# Altium project Room02.PrjPCB
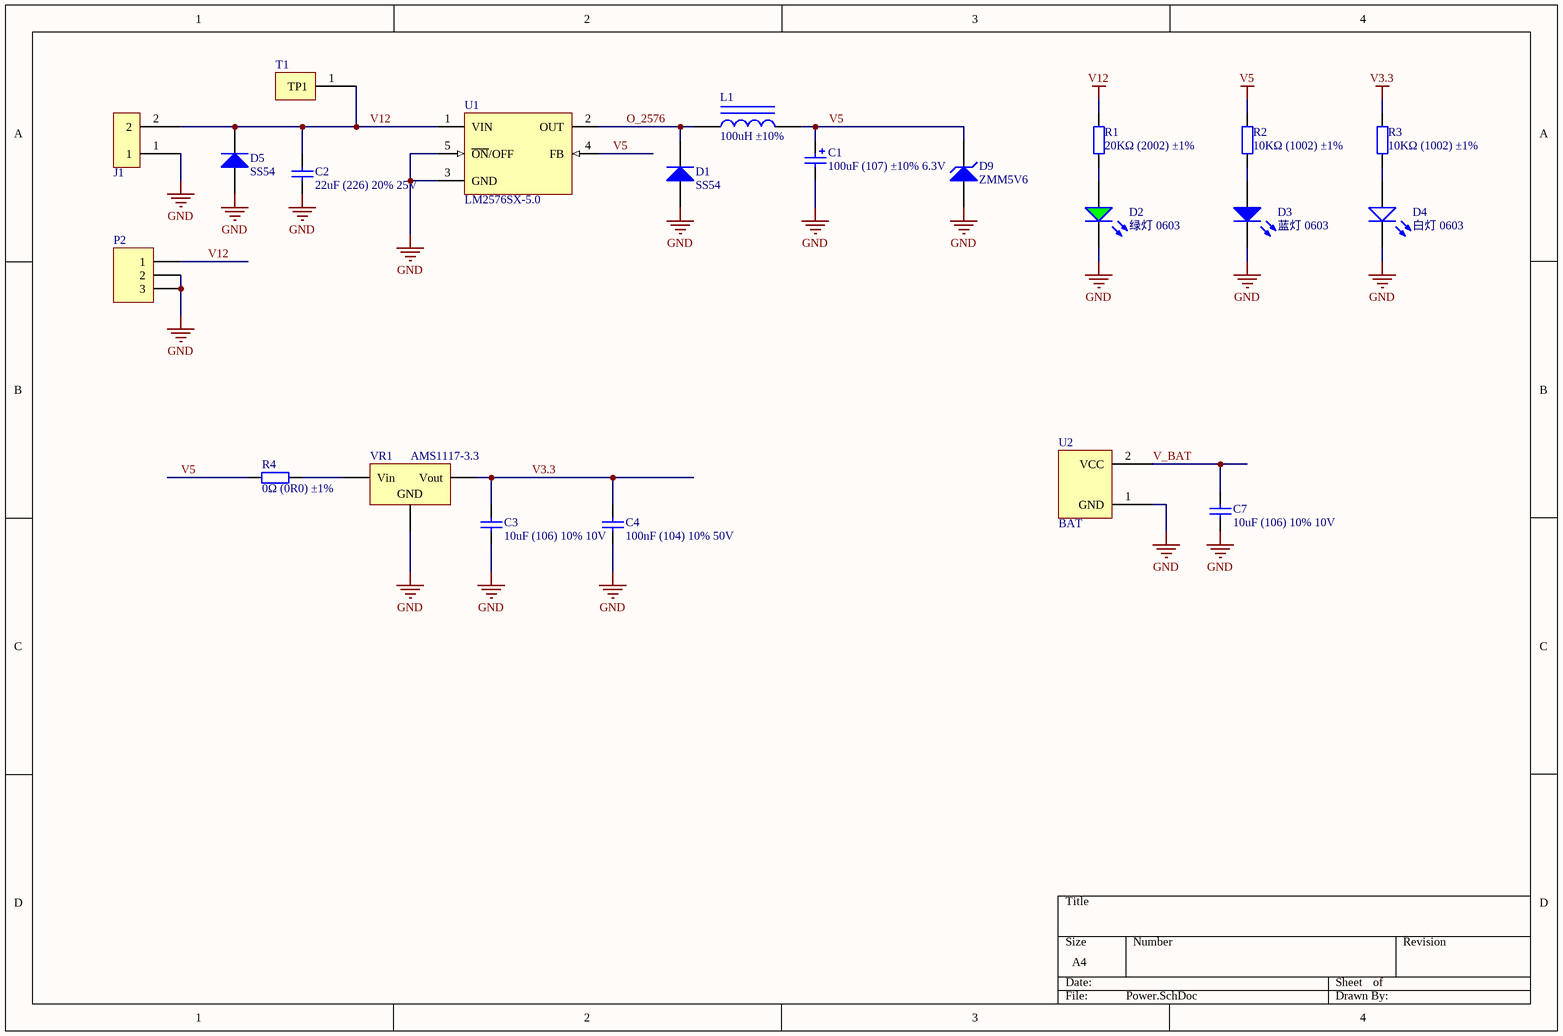
[diagram p0: Power.SchDoc]
5 sheets, 94 parts. Net scope: global (net labels, ports and power ports of the same name join across sheets).
Board file: Room02.PcbDoc
Sheets:
  Power.SchDoc
  raspi.SchDoc
  commu.SchDoc
  mcu.SchDoc
  other.SchDoc

## Sheet Power.SchDoc
size A4

### Parts
C1  100uF (107) ±10% 6.3V  [CASE-B_3528]
C2  22uF (226) 20% 25V  [0805_C]
C3  10uF (106) 10% 10V  [0603_C]
C4  100nF (104) 10% 50V  [0603_C]
C7  10uF (106) 10% 10V  [0603_C]
D1  SS54  [SMA(DO-214AC)_S1]
D2  绿灯 0603  [0603_LED_S1]
D3  蓝灯 0603  [0603_LED_S1]
D4  白灯 0603  [0603_LED_S1]
D5  SS54  [SMA(DO-214AC)_S1]
D9  ZMM5V6  [LL-34]
J1  XK7.62-2P  [XK7.62-2P]  (value not drawn)
L1  100uH ±10%  [0805_L]
P2  Header 3  [DC005]  (value not drawn)
R1  20KΩ (2002) ±1%  [0603_R]
R2  10KΩ (1002) ±1%  [0603_R]
R3  10KΩ (1002) ±1%  [0603_R]
R4  0Ω (0R0) ±1%  [1206_R]
T1  TP1  [TP1]  (value not drawn)
U1  LM2576SX-5.0  [TO-263-5]
U2  BAT  [BAT2032]
VR1  AMS1117-3.3  [SOT-223]

### Nets
GND: C1.2 C2.1 C3.1 C4.1 C7.1 D1.1(A) D2.K D3.K D4.K D5.1(A) D9.1(A) J1.1 P2.2 P2.3 U1.3(GND) U1.5(~{ON}/OFF) U2.1(GND) VR1.1(GND)
V3.3: C3.2 C4.2 R3.2 VR1.2(Vout)
V5: C1.1 D9.2(K) L1.2 R2.2 R4.1 U1.4(FB)
V12: C2.2 D5.2(K) J1.2 P2.1 R1.2 T1.1(TP1) U1.1(VIN)
O_2576: D1.2(K) L1.1 U1.2(OUT)
V_BAT: C7.2 U2.2(VCC)
NetD2_A: D2.A R1.1
NetD3_A: D3.A R2.1
NetD4_A: D4.A R3.1
NetR4_2: R4.2 VR1.3(Vin)

### Library data of the parts
C1 = 3528 100uF (107) 10% 6.3V: 钽电容; ComponentLink1Description: 供应商链接; ComponentLink1URL: http://www.szlcsc.com/product/details_16815.html; Package: 3528; Supplier: LC; SuppliersPartNumber: C16133
C2 = 0805 22uF (226) 20% 25V: 贴片电容; ComponentLink1Description: 供应商链接; ComponentLink1URL: http://www.szlcsc.com/product/details_46786.html; Package: 0805; Supplier: LC; SuppliersPartNumber: C45783
C3 C7 = 0603 10uF (106) 10% 10V: 贴片电容; ComponentLink1Description: 供应商链接; ComponentLink1URL: http://www.szlcsc.com/product/details_20411.html; Package: 0603; Supplier: LC; SuppliersPartNumber: C19702
C4 = 0603 100nF (104) 10% 50V: 贴片电容; ComponentLink1Description: 供应商链接; ComponentLink1URL: http://www.szlcsc.com/product/details_15331.html; Package: 0603; Supplier: LC; SuppliersPartNumber: C14663
D1 D5 = SMA(DO-214AC) SS54: 二极管; ComponentLink1Description: 供应商链接; ComponentLink1URL: http://www.szlcsc.com/product/details_23178.html; Package: SMA(DO-214AC); Supplier: LC; SuppliersPartNumber: C22452
D2 = 0603 绿灯: 发光二极管; ComponentLink1Description: 供应商链接; ComponentLink1URL: http://www.szlcsc.com/product/details_73152.html; Package: 0603; Supplier: LC; SuppliersPartNumber: C72043
D3 = 0603 蓝灯: 发光二极管; ComponentLink1Description: 供应商链接; ComponentLink1URL: http://www.szlcsc.com/product/details_73150.html; Package: 0603; Supplier: LC; SuppliersPartNumber: C72041
D4 = 0603 白灯: 发光二极管; ComponentLink1Description: 供应商链接; ComponentLink1URL: http://www.szlcsc.com/product/details_2663.html; Package: 0603; Supplier: LC; SuppliersPartNumber: C2290
D9 = LL-34 ZMM5V6: 稳压二极管; ComponentLink1Description: 供应商链接; ComponentLink1URL: http://www.szlcsc.com/product/details_8541.html; Package: LL-34; Supplier: LC; SuppliersPartNumber: C8062
L1 = 0805 100uH 10%: 贴片电感; ComponentLink1Description: 供应商链接; ComponentLink1URL: http://www.szlcsc.com/product/details_69137.html; Package: 0805; Supplier: LC; SuppliersPartNumber: C68035
P2 = Header 3: Header, 3-Pin; LatestRevisionDate: 17-Jul-2002; LatestRevisionNote: Re-released for DXP Platform.; Publisher: Altium Limited
R1 = 0603 20KΩ (2002) 1%: 贴片电阻; ComponentLink1Description: 供应商链接; ComponentLink1URL: http://www.szlcsc.com/product/details_4591.html; Package: 0603; Supplier: LC; SuppliersPartNumber: C4184
R2 R3 = 0603 10KΩ (1002) 1%: 贴片电阻; ComponentLink1Description: 供应商链接; ComponentLink1URL: http://www.szlcsc.com/product/details_26547.html; Package: 0603; Supplier: LC; SuppliersPartNumber: C25804
R4 = 1206 0Ω (0R0) 1%: 贴片电阻; ComponentLink1Description: 供应商链接; ComponentLink1URL: http://www.szlcsc.com/product/details_18576.html; Package: 1206; Supplier: LC; SuppliersPartNumber: C17888
U1 = LM2576SX-5.0_[C34465]: DC-DC芯片; ComponentLink1Description: 供应商链接; ComponentLink1URL: http://www.szlcsc.com/product/details_35434.html; Package: TO-263-5; Supplier: LC; SuppliersPartNumber: C34465
U2 = BAT2032
VR1 = SOT-223 AMS1117-3.3: 低压差线性稳压(LDO); ComponentLink1Description: 供应商链接; ComponentLink1URL: http://www.szlcsc.com/product/details_6652.html; Package: SOT-223; Supplier: LC; SuppliersPartNumber: C6186

## Sheet raspi.SchDoc
size A4
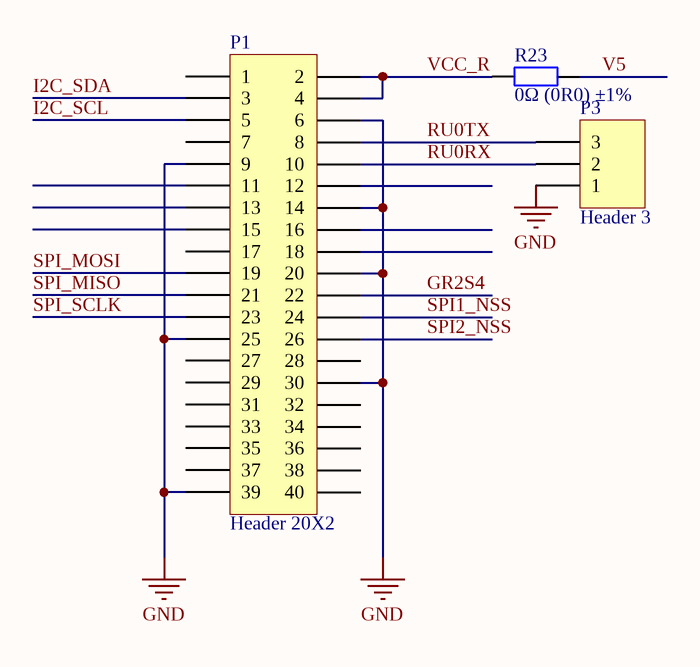
[diagram p1: raspi.SchDoc]

### Parts
P1  Header 20X2  [HDR2X20]
P3  Header 3  [HDR1X3]
R23  0Ω (0R0) ±1%  [1206_R]

### Nets
GND: P1.6 P1.9 P1.14 P1.20 P1.25 P1.30 P1.39 P3.1
V5: R23.2
GR2S4: P1.22
I2C_SCL: P1.5
I2C_SDA: P1.3
RU0RX: P1.10 P3.2
RU0TX: P1.8 P3.3
SPI1_NSS: P1.24
SPI2_NSS: P1.26
SPI_MISO: P1.21
SPI_MOSI: P1.19
SPI_SCLK: P1.23
VCC_R: P1.2 P1.4 R23.1

Not connected (* = marked no-connect by the designer): P1 1 7 11 12 13 15 16 17 18 27 28 29 31 32 33 34 35 36 37 38 40

### Library data of the parts
P1 = Header 20X2: Header, 20-Pin, Dual row; LatestRevisionDate: 17-Jul-2002; LatestRevisionNote: Re-released for DXP Platform.; Publisher: Altium Limited
P3 = Header 3: Header, 3-Pin; LatestRevisionDate: 17-Jul-2002; LatestRevisionNote: Re-released for DXP Platform.; Publisher: Altium Limited
R23 = 1206 0Ω (0R0) 1%: 贴片电阻; ComponentLink1Description: 供应商链接; ComponentLink1URL: http://www.szlcsc.com/product/details_18576.html; Package: 1206; Supplier: LC; SuppliersPartNumber: C17888

## Sheet commu.SchDoc
size A4
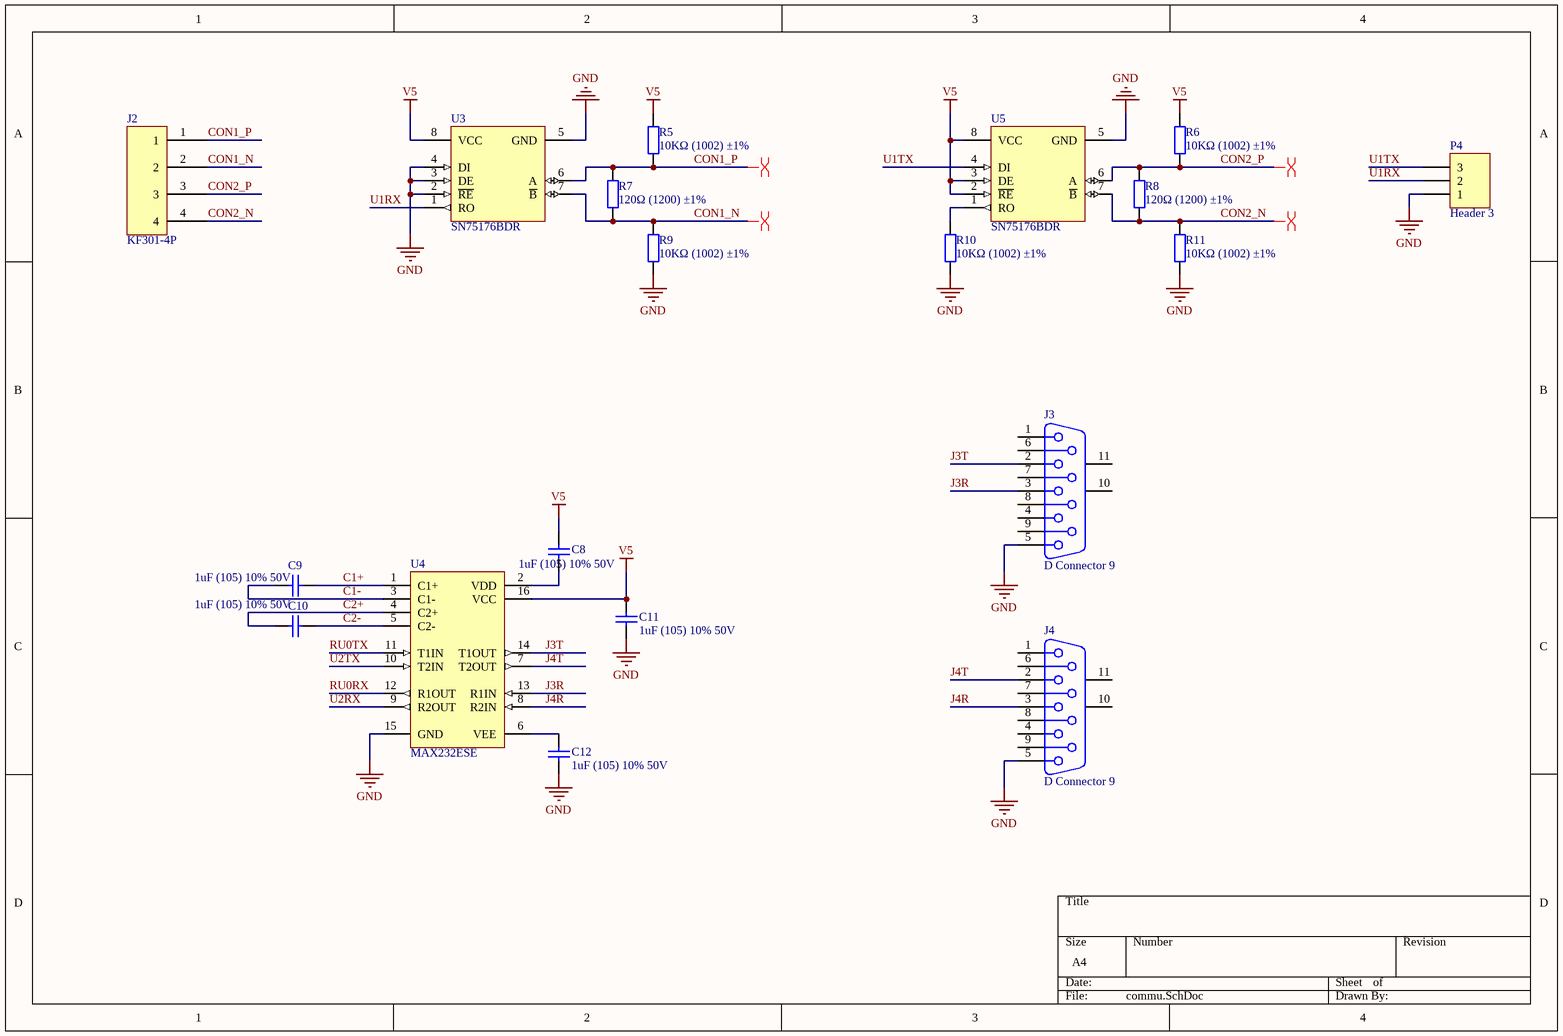
[diagram p2: commu.SchDoc]

### Parts
C8  1uF (105) 10% 50V  [0603_C]
C9  1uF (105) 10% 50V  [0603_C]
C10  1uF (105) 10% 50V  [0603_C]
C11  1uF (105) 10% 50V  [0603_C]
C12  1uF (105) 10% 50V  [0603_C]
J2  KF301-4P  [KF301-4P]
J3  D Connector 9  [DSUB1.385-2H9]
J4  D Connector 9  [DSUB1.385-2H9]
P4  Header 3  [HDR1X3]
R5  10KΩ (1002) ±1%  [0603_R]
R6  10KΩ (1002) ±1%  [0603_R]
R7  120Ω (1200) ±1%  [0603_R]
R8  120Ω (1200) ±1%  [0603_R]
R9  10KΩ (1002) ±1%  [0603_R]
R10  10KΩ (1002) ±1%  [0603_R]
R11  10KΩ (1002) ±1%  [0603_R]
U3  SN75176BDR  [SOIC-8_150mil]
U4  MAX232ESE  [SOIC-16_150mil]
U5  SN75176BDR  [SOIC-8_150mil]

### Nets
GND: C11.1 C12.1 J3.5 J4.5 P4.1 R9.1 R10.1 R11.1 U3.2(~{RE}) U3.3(DE) U3.4(DI) U3.5(GND) U4.15(GND) U5.5(GND)
V5: C8.2 C11.2 R5.2 R6.2 U3.8(VCC) U4.16(VCC) U5.2(~{RE}) U5.3(DE) U5.8(VCC)
C1+: C9.2 U4.1(C1+)
C1-: C9.1 U4.3(C1-)
C2+: C10.1 U4.4(C2+)
C2-: C10.2 U4.5(C2-)
CON1_N: J2.2 R7.1 R9.2 U3.7(~{B})
CON1_P: J2.1 R5.1 R7.2 U3.6(A)
CON2_N: J2.4 R8.1 R11.2 U5.7(~{B})
CON2_P: J2.3 R6.1 R8.2 U5.6(A)
J3R: J3.3 U4.13(R1IN)
J3T: J3.2 U4.14(T1OUT)
J4R: J4.3 U4.8(R2IN)
J4T: J4.2 U4.7(T2OUT)
RU0RX: U4.12(R1OUT)
RU0TX: U4.11(T1IN)
U1RX: P4.2 U3.1(RO)
U1TX: P4.3 U5.4(DI)
U2RX: U4.9(R2OUT)
U2TX: U4.10(T2IN)
NetC8_1: C8.1 U4.2(VDD)
NetC12_2: C12.2 U4.6(VEE)
NetR10_2: R10.2 U5.1(RO)

Not connected (* = marked no-connect by the designer): J3 1 4 6 7 8 9 10(MH1) 11(MH2); J4 1 4 6 7 8 9 10(MH1) 11(MH2)

### Layout directives
differential pair: CON1_N, CON1_P, CON2_N, CON2_P

### Library data of the parts
C8-C12 = 0603 1uF (105) 10% 50V: 贴片电容; ComponentLink1Description: 供应商链接; ComponentLink1URL: http://www.szlcsc.com/product/details_16531.html; Package: 0603; Supplier: LC; SuppliersPartNumber: C15849
J3 J4 = D Connector 9: Receptacle Assembly, 9 Position, Right Angle; PackageDocument: O; Positions: 9; Published: 15-Jun-2001; LatestRevisionDate: 17-Jul-2002; LatestRevisionNote: Re-released for DXP Platform.; DatasheetDocument: 1-Sep-1999; PackageReference: 788750; Publisher: Altium Limited; Orientation: Right Angle; Gender: Receptacle
P4 = Header 3: Header, 3-Pin; LatestRevisionDate: 17-Jul-2002; LatestRevisionNote: Re-released for DXP Platform.; Publisher: Altium Limited
R5 R6 R9-R11 = 0603 10KΩ (1002) 1%: 贴片电阻; ComponentLink1Description: 供应商链接; ComponentLink1URL: http://www.szlcsc.com/product/details_26547.html; Package: 0603; Supplier: LC; SuppliersPartNumber: C25804
R7 R8 = 0603 120Ω (1200) 1%: 贴片电阻; ComponentLink1Description: 供应商链接; ComponentLink1URL: http://www.szlcsc.com/product/details_23514.html; Package: 0603; Supplier: LC; SuppliersPartNumber: C22787
U3 U5 = SN75176BDR_[C7063]: RS-485/RS-422; ComponentLink1Description: 供应商链接; ComponentLink1URL: http://www.szlcsc.com/product/details_7535.html; Package: SOIC-8_150mil; Supplier: LC; SuppliersPartNumber: C7063
U4 = MAX232ESE_[C26860]: RS232; ComponentLink1Description: 供应商链接; ComponentLink1URL: http://www.szlcsc.com/product/details_27608.html; Package: SOIC-16_150mil; Supplier: LC; SuppliersPartNumber: C26860

## Sheet mcu.SchDoc
size A4
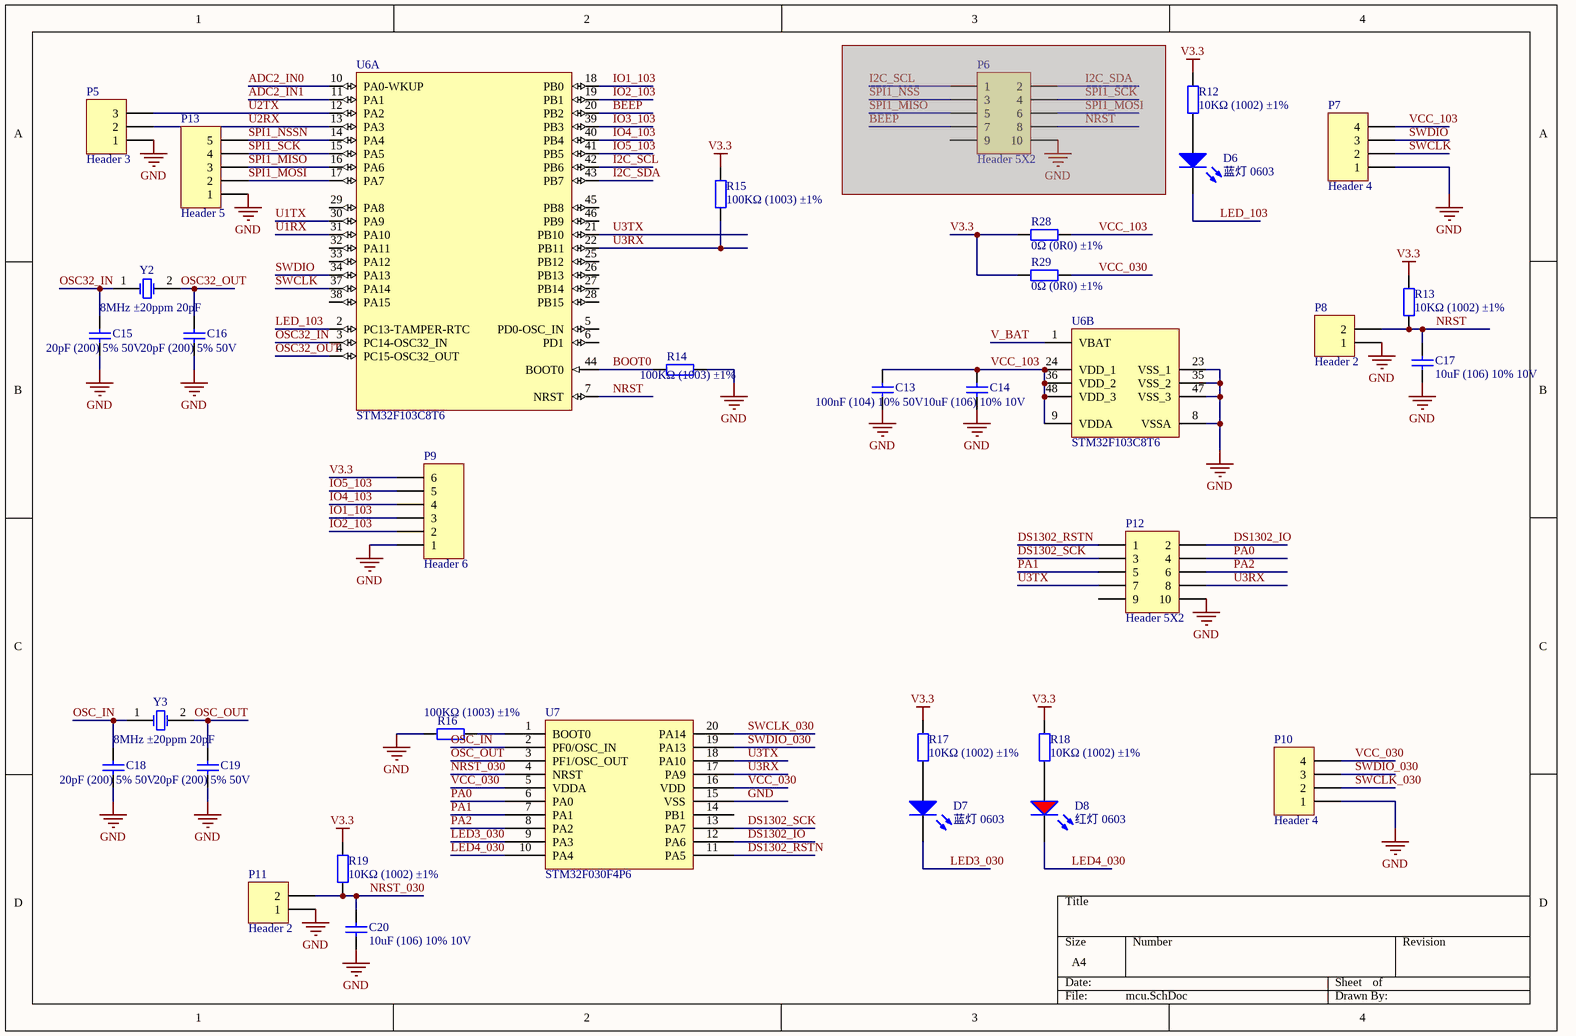
[diagram p3: mcu.SchDoc]

### Parts
C13  100nF (104) 10% 50V  [0603_C]
C14  10uF (106) 10% 10V  [0603_C]
C15  20pF (200) 5% 50V  [0402_C]
C16  20pF (200) 5% 50V  [0402_C]
C17  10uF (106) 10% 10V  [0603_C]
C18  20pF (200) 5% 50V  [0402_C]
C19  20pF (200) 5% 50V  [0402_C]
C20  10uF (106) 10% 10V  [0603_C]
D6  蓝灯 0603  [0603_LED_S1]
D7  蓝灯 0603  [0603_LED_S1]
D8  红灯 0603  [0603_LED_S1]
P5  Header 3  [HDR1X3]
P6  Header 5X2  [HDR2X5]  (masked out: inside a compile mask, not in the netlist)
P7  Header 4  [HDR1X4]
P8  Header 2  [HDR1X2]
P9  Header 6  [HDR1X6]
P10  Header 4  [HDR1X4]
P11  Header 2  [HDR1X2]
P12  Header 5X2  [HDR2X5]
P13  Header 5  [HDR1X5]
R12  10KΩ (1002) ±1%  [0402_R]
R13  10KΩ (1002) ±1%  [0402_R]
R14  100KΩ (1003) ±1%  [0603_R]
R15  100KΩ (1003) ±1%  [0402_R]
R16  100KΩ (1003) ±1%  [0402_R]
R17  10KΩ (1002) ±1%  [0402_R]
R18  10KΩ (1002) ±1%  [0402_R]
R19  10KΩ (1002) ±1%  [0402_R]
R28  0Ω (0R0) ±1%  [1206_R]
R29  0Ω (0R0) ±1%  [1206_R]
U6  STM32F103C8T6  [LQFP-48_7x7x05P]  (parts A,B of 2)
U7  STM32F030F4P6  [TSSOP-20]
Y2  8MHz ±20ppm 20pF  [SMD-5032_2P]
Y3  8MHz ±20ppm 20pF  [SMD-5032_2P]

### Nets
GND: C13.1 C14.2 C15.1 C16.1 C17.1 C18.1 C19.1 C20.1 P5.1 P7.1 P8.1 P9.1 P10.1 P11.1 P12.10 P13.1 R14.2 R16.1 U6.8(VSSA) U6.23(VSS_1) U6.35(VSS_2) U6.47(VSS_3) U7.15(VSS)
V3.3: P9.6 R12.2 R13.2 R15.2 R17.2 R18.2 R19.2 R28.1 R29.1
ADC2_IN0: U6.10(PA0-WKUP)
ADC2_IN1: U6.11(PA1)
BEEP: U6.20(PB2)
BOOT0: R14.1 U6.44(BOOT0)
DS1302_IO: P12.2 U7.12(PA6)
DS1302_RSTN: P12.1 U7.11(PA5)
DS1302_SCK: P12.3 U7.13(PA7)
I2C_SCL: U6.42(PB6)
I2C_SDA: U6.43(PB7)
IO1_103: P9.3 U6.18(PB0)
IO2_103: P9.2 U6.19(PB1)
IO3_103: U6.39(PB3)
IO4_103: P9.4 U6.40(PB4)
IO5_103: P9.5 U6.41(PB5)
LED3_030: D7.K U7.9(PA3)
LED4_030: D8.K U7.10(PA4)
LED_103: D6.K U6.2(PC13-TAMPER-RTC)
NRST: C17.2 P8.2 R13.1 U6.7(NRST)
NRST_030: C20.2 P11.2 R19.1 U7.4(NRST)
OSC32_IN: C15.2 U6.3(PC14-OSC32_IN) Y2.1(OSC1)
OSC32_OUT: C16.2 U6.4(PC15-OSC32_OUT) Y2.2(OSC2)
OSC_IN: C18.2 U7.2(PF0/OSC_IN) Y3.1(OSC1)
OSC_OUT: C19.2 U7.3(PF1/OSC_OUT) Y3.2(OSC2)
PA0: P12.4 U7.6(PA0)
PA1: P12.5 U7.7(PA1)
PA2: P12.6 U7.8(PA2)
SPI1_MISO: P13.3 U6.16(PA6)
SPI1_MOSI: P13.2 U6.17(PA7)
SPI1_NSSN: P13.5 U6.14(PA4)
SPI1_SCK: P13.4 U6.15(PA5)
SWCLK: P7.2 U6.37(PA14)
SWCLK_030: P10.2 U7.20(PA14)
SWDIO: P7.3 U6.34(PA13)
SWDIO_030: P10.3 U7.19(PA13)
U1RX: U6.31(PA10)
U1TX: U6.30(PA9)
U2RX: P5.2 U6.13(PA3)
U2TX: P5.3 U6.12(PA2)
U3RX: P12.8 R15.1 U6.22(PB11) U7.17(PA9)
U3TX: P12.7 U6.21(PB10) U7.18(PA10)
V_BAT: U6.1(VBAT)
VCC_030: P10.4 R29.2 U7.5(VDDA) U7.16(VDD)
VCC_103: C13.2 C14.1 P7.4 R28.2 U6.9(VDDA) U6.24(VDD_1) U6.36(VDD_2) U6.48(VDD_3)
NetD6_A: D6.A R12.1
NetD7_A: D7.A R17.1
NetD8_A: D8.A R18.1
NetR16_2: R16.2 U7.1(BOOT0)

Not connected (* = marked no-connect by the designer): P12 9; U6 5(PD0-OSC_IN) 6(PD1) 25(PB12) 26(PB13) 27(PB14) 28(PB15) 29(PA8) 32(PA11) 33(PA12) 38(PA15) 45(PB8) 46(PB9); U7 14(PB1)

### Library data of the parts
C13 = 0603 100nF (104) 10% 50V: 贴片电容; ComponentLink1Description: 供应商链接; ComponentLink1URL: http://www.szlcsc.com/product/details_15331.html; Package: 0603; Supplier: LC; SuppliersPartNumber: C14663
C14 C17 C20 = 0603 10uF (106) 10% 10V: 贴片电容; ComponentLink1Description: 供应商链接; ComponentLink1URL: http://www.szlcsc.com/product/details_20411.html; Package: 0603; Supplier: LC; SuppliersPartNumber: C19702
C15 C16 C18 C19 = 0402 20pF (200) 5% 50V: 贴片电容; ComponentLink1Description: 供应商链接; ComponentLink1URL: http://www.szlcsc.com/product/details_1906.html; Package: 0402; Supplier: LC; SuppliersPartNumber: C1554
D6 D7 = 0603 蓝灯: 发光二极管; ComponentLink1Description: 供应商链接; ComponentLink1URL: http://www.szlcsc.com/product/details_73150.html; Package: 0603; Supplier: LC; SuppliersPartNumber: C72041
D8 = 0603 红灯: 发光二极管; ComponentLink1Description: 供应商链接; ComponentLink1URL: http://www.szlcsc.com/product/details_2659.html; Package: 0603; Supplier: LC; SuppliersPartNumber: C2286
P5 = Header 3: Header, 3-Pin; LatestRevisionDate: 17-Jul-2002; LatestRevisionNote: Re-released for DXP Platform.; Publisher: Altium Limited
P6 P12 = Header 5X2: Header, 5-Pin, Dual row; LatestRevisionDate: 17-Jul-2002; LatestRevisionNote: Re-released for DXP Platform.; Publisher: Altium Limited
P7 P10 = Header 4: Header, 4-Pin; LatestRevisionDate: 17-Jul-2002; LatestRevisionNote: Re-released for DXP Platform.; Publisher: Altium Limited
P8 P11 = Header 2: Header, 2-Pin; LatestRevisionDate: 17-Jul-2002; LatestRevisionNote: Re-released for DXP Platform.; Publisher: Altium Limited
P9 = Header 6: Header, 6-Pin; LatestRevisionDate: 17-Jul-2002; LatestRevisionNote: Re-released for DXP Platform.; Publisher: Altium Limited
P13 = Header 5: Header, 5-Pin; LatestRevisionDate: 17-Jul-2002; LatestRevisionNote: Re-released for DXP Platform.; Publisher: Altium Limited
R12 R13 R17-R19 = 0402 10KΩ (1002) 1%: 贴片电阻; ComponentLink1Description: 供应商链接; ComponentLink1URL: http://www.szlcsc.com/product/details_26487.html; Package: 0402; Supplier: LC; SuppliersPartNumber: C25744
R14 = 0603 100KΩ (1003) 1%: 贴片电阻; ComponentLink1Description: 供应商链接; ComponentLink1URL: http://www.szlcsc.com/product/details_26546.html; Package: 0603; Supplier: LC; SuppliersPartNumber: C25803
R15 R16 = 0402 100KΩ (1003) 1%: 贴片电阻; ComponentLink1Description: 供应商链接; ComponentLink1URL: http://www.szlcsc.com/product/details_26484.html; Package: 0402; Supplier: LC; SuppliersPartNumber: C25741
R28 R29 = 1206 0Ω (0R0) 1%: 贴片电阻; ComponentLink1Description: 供应商链接; ComponentLink1URL: http://www.szlcsc.com/product/details_18576.html; Package: 1206; Supplier: LC; SuppliersPartNumber: C17888
U6 = STM32F103C8T6: ARM; ComponentLink1Description: 供应商链接; ComponentLink1URL: http://www.szlcsc.com/product/details_9243.html; Package: LQFP-48_7x7x05P; Supplier: LC; SuppliersPartNumber: C8734
U7 = STM32F030F4P6: ARM; ComponentLink1Description: 供应商链接; ComponentLink1URL: http://www.szlcsc.com/product/details_33873.html; Package: TSSOP-20; Supplier: LC; SuppliersPartNumber: C32908
Y2 Y3 = SMD-5032_2P 8MHz 20ppm 20pF: 贴片晶振; ComponentLink1Description: 供应商链接; ComponentLink1URL: http://www.szlcsc.com/product/details_117214.html; Package: SMD-5032_2P; Supplier: LC; SuppliersPartNumber: C115962

## Sheet other.SchDoc
size A4
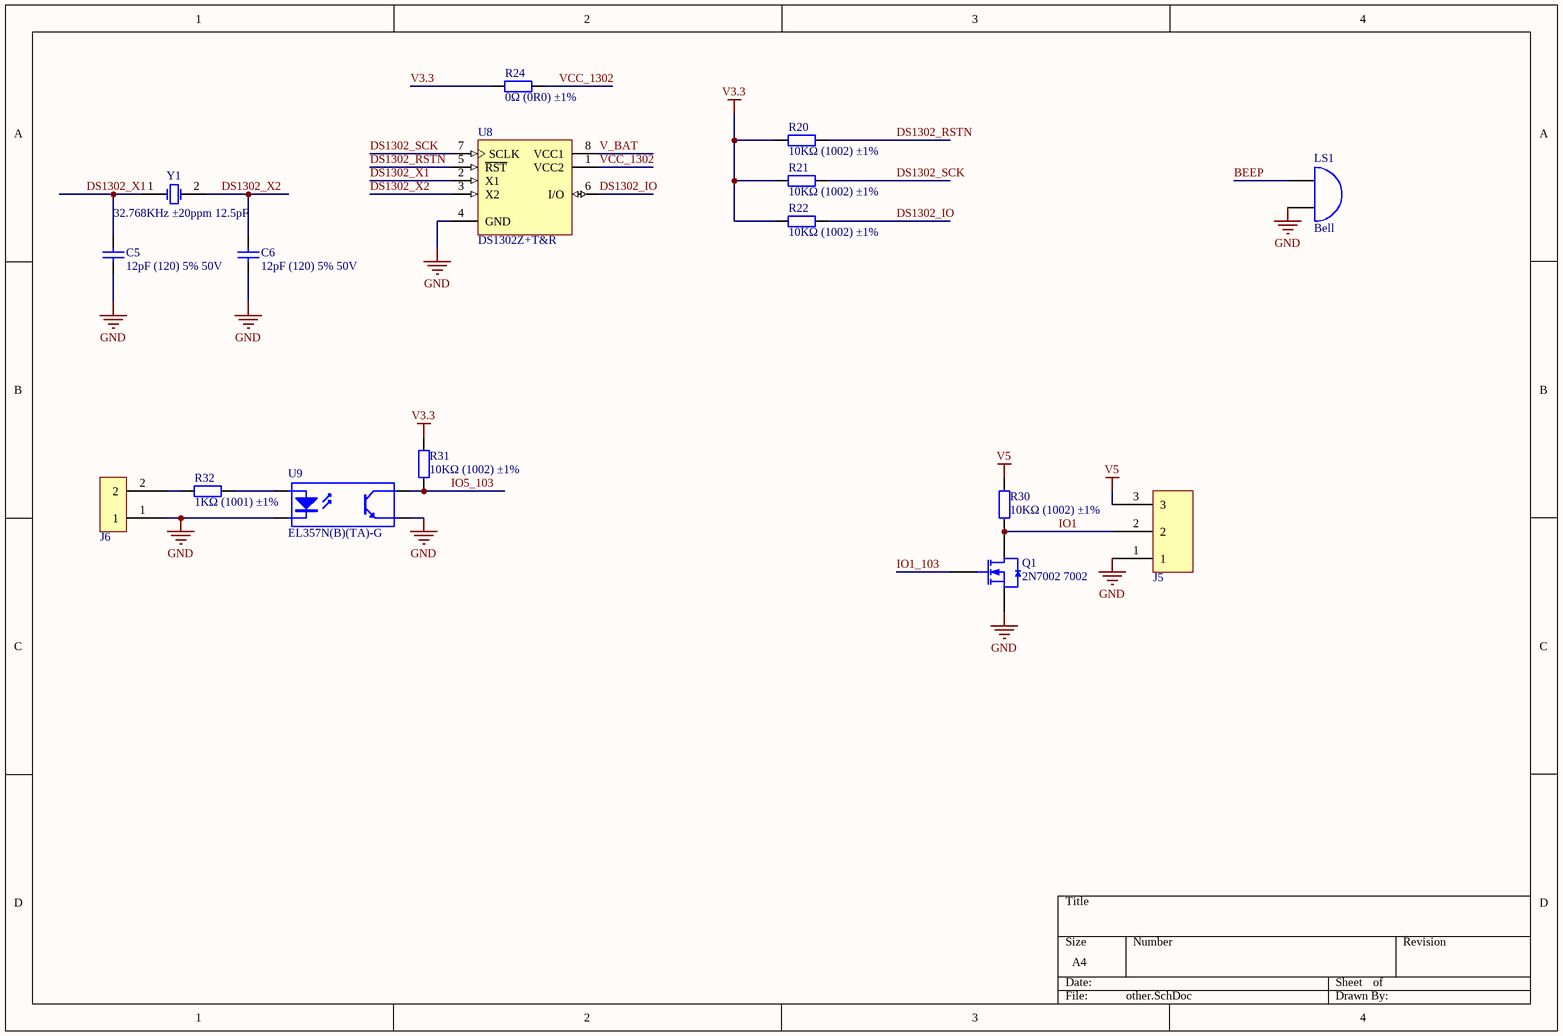
[diagram p4: other.SchDoc]

### Parts
C5  12pF (120) 5% 50V  [0402_C]
C6  12pF (120) 5% 50V  [0402_C]
J5  KF301-3P  [KF301-3P]  (value not drawn)
J6  KF301-2P  [KF301-2P]  (value not drawn)
LS1  Bell  [PIN2]
Q1  2N7002 7002  [SOT-23(SOT-23-3)]
R20  10KΩ (1002) ±1%  [0402_R]
R21  10KΩ (1002) ±1%  [0402_R]
R22  10KΩ (1002) ±1%  [0402_R]
R24  0Ω (0R0) ±1%  [1206_R]
R30  10KΩ (1002) ±1%  [1206_R]
R31  10KΩ (1002) ±1%  [1206_R]
R32  1KΩ (1001) ±1%  [1206_R]
U8  DS1302Z+T&R  [SOIC-8_150mil]
U9  EL357N(B)(TA)-G  [SOP-4_P2.54]
Y1  32.768KHz ±20ppm 12.5pF  [SMD-3215_2P FC - 135]

### Nets
GND: C5.1 C6.1 J5.1 J6.1 LS1.2(B) Q1.2(S) U8.4(GND) U9.2(K) U9.3(E)
V3.3: R20.1 R21.1 R22.1 R24.1 R31.2
V5: J5.3 R30.2
BEEP: LS1.1(A)
DS1302_IO: R22.2 U8.6(I/O)
DS1302_RSTN: R20.2 U8.5(~{RST})
DS1302_SCK: R21.2 U8.7(SCLK)
DS1302_X1: C5.2 U8.2(X1) Y1.1(OSC1)
DS1302_X2: C6.2 U8.3(X2) Y1.2(OSC2)
IO1: J5.2 Q1.3(D) R30.1
IO1_103: Q1.1(G)
IO5_103: R31.1 U9.4(C)
V_BAT: U8.8(VCC1)
VCC_1302: R24.2 U8.1(VCC2)
NetJ6_2: J6.2 R32.1
NetR32_2: R32.2 U9.1(A)

### Library data of the parts
C5 C6 = 0402 12pF (120) 5% 50V: 贴片电容; ComponentLink1Description: 供应商链接; ComponentLink1URL: http://www.szlcsc.com/product/details_1899.html; Package: 0402; Supplier: LC; SuppliersPartNumber: C1547
LS1 = Bell: Electrical Bell; Published: 24-Mar-1999; LatestRevisionDate: 17-Jul-2002; LatestRevisionNote: Re-released for DXP Platform.; PackageReference: PIN2; Publisher: Altium Limited
Q1 = 2N7002 7002: MOS(场效应管); ComponentLink1Description: 供应商链接; ComponentLink1URL: http://www.szlcsc.com/product/details_9040.html; Package: SOT-23(SOT-23-3); Supplier: LC; SuppliersPartNumber: C8545
R20-R22 = 0402 10KΩ (1002) 1%: 贴片电阻; ComponentLink1Description: 供应商链接; ComponentLink1URL: http://www.szlcsc.com/product/details_26487.html; Package: 0402; Supplier: LC; SuppliersPartNumber: C25744
R24 = 1206 0Ω (0R0) 1%: 贴片电阻; ComponentLink1Description: 供应商链接; ComponentLink1URL: http://www.szlcsc.com/product/details_18576.html; Package: 1206; Supplier: LC; SuppliersPartNumber: C17888
R30 R31 = 1206 10KΩ (1002) 1%: 贴片电阻; ComponentLink1Description: 供应商链接; ComponentLink1URL: http://www.szlcsc.com/product/details_18590.html; Package: 1206; Supplier: LC; SuppliersPartNumber: C17902
R32 = 1206 1KΩ (1001) 1%: 贴片电阻; ComponentLink1Description: 供应商链接; ComponentLink1URL: http://www.szlcsc.com/product/details_4817.html; Package: 1206; Supplier: LC; SuppliersPartNumber: C4410
U8 = DS1302Z+T&R_[C8959]: 实时时钟; ComponentLink1Description: 供应商链接; ComponentLink1URL: http://www.szlcsc.com/product/details_9478.html; Package: SOIC-8_150mil; Supplier: LC; SuppliersPartNumber: C8959
U9 = EL357N(B)(TA)-G_[C6649]: 贴片光耦; ComponentLink1Description: 供应商链接; ComponentLink1URL: http://www.szlcsc.com/product/details_7114.html; Package: SOP-4_P2.54; Supplier: LC; SuppliersPartNumber: C6649
Y1 = SMD-3215_2P 32.768KHz 20ppm 12.5pF: 贴片晶振; ComponentLink1Description: 供应商链接; ComponentLink1URL: http://www.szlcsc.com/product/details_33310.html; Package: SMD-3215_2P; Supplier: LC; SuppliersPartNumber: C32346

## Nets that join several sheets
GND: Power (18 pins), raspi (8 pins), commu (14 pins), mcu (23 pins), other (9 pins)
V3.3: Power (C3.2 C4.2 R3.2 VR1.2), mcu (9 pins), other (5 pins)
V5: Power (6 pins), raspi (R23.2), commu (9 pins), other (J5.3 R30.2)
BEEP: mcu (U6.20), other (LS1.1)
DS1302_IO: mcu (P12.2 U7.12), other (R22.2 U8.6)
DS1302_RSTN: mcu (P12.1 U7.11), other (R20.2 U8.5)
DS1302_SCK: mcu (P12.3 U7.13), other (R21.2 U8.7)
I2C_SCL: raspi (P1.5), mcu (U6.42)
I2C_SDA: raspi (P1.3), mcu (U6.43)
IO1_103: mcu (P9.3 U6.18), other (Q1.1)
IO5_103: mcu (P9.5 U6.41), other (R31.1 U9.4)
RU0RX: raspi (P1.10 P3.2), commu (U4.12)
RU0TX: raspi (P1.8 P3.3), commu (U4.11)
U1RX: commu (P4.2 U3.1), mcu (U6.31)
U1TX: commu (P4.3 U5.4), mcu (U6.30)
U2RX: commu (U4.9), mcu (P5.2 U6.13)
U2TX: commu (U4.10), mcu (P5.3 U6.12)
V_BAT: Power (C7.2 U2.2), mcu (U6.1), other (U8.8)